# EAGLE design referenceCard (EAGLE 7.1.0)
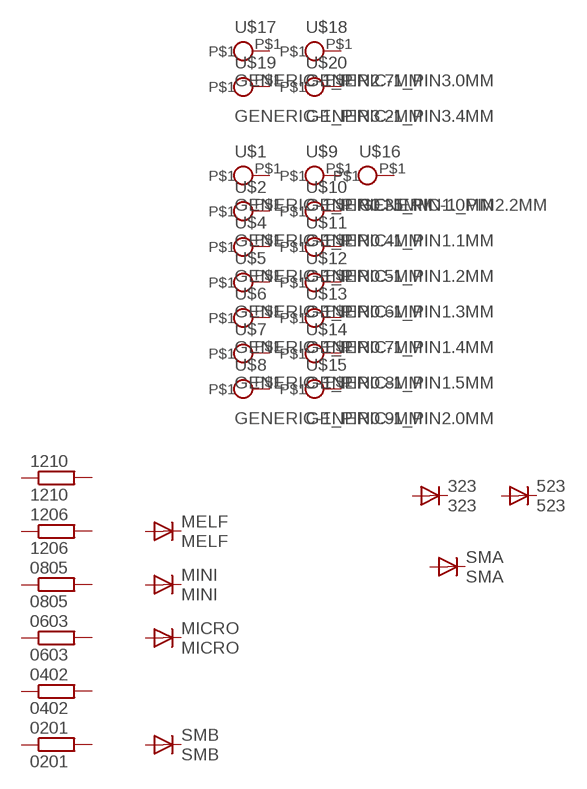
[diagram p0: schematic, sheet 1]

## Parts
0201  0201  R-EU_R0201  [R0201]
323  323  DIODESOD  [SOD-323]
0402  0402  R-EU_R0402  [R0402]
523  523  DIODESOD523  [SOD523]
0603  0603  R-EU_R0603  [R0603]
0805  0805  R-EU_R0805  [R0805]
1206  1206  R-EU_R1206  [R1206]
1210  1210  R-EU_R1210  [R1210]
MELF  MELF  DIODE-MELF-MLL41  [MELF-MLL41]
MICRO  MICRO  DIODE-MICROMELF-R  [MICROMELF-R]
MINI  MINI  DIODE-MINIMELF  [MINIMELF]
SMA  SMA  DIODESMA-KIT  [SMA-DIODE-KIT]
SMB  SMB  DIODESMB  [SMB-DIODE]
U$1  GENERIC-1_PIN0.35MM  [GENERIC-SINGLE-0_35]
U$2  GENERIC-1_PIN0.4MM  [GENERIC_SINGLE-0_4]
U$4  GENERIC-1_PIN0.5MM  [GENERIC_SINGLE-0_5]
U$5  GENERIC-1_PIN0.6MM  [GENERIC_SINGLE-0_6]
U$6  GENERIC-1_PIN0.7MM  [GENERIC_SINGLE-0_7]
U$7  GENERIC-1_PIN0.8MM  [GENERIC_SINGLE-0_8]
U$8  GENERIC-1_PIN0.9MM  [GENERIC_SINGLE-0_9]
U$9  GENERIC-1_PIN1.0MM  [GENERIC_SINGLE-1_0]
U$10  GENERIC-1_PIN1.1MM  [GENERIC_SINGLE-1_1]
U$11  GENERIC-1_PIN1.2MM  [GENERIC_SINGLE-1_2]
U$12  GENERIC-1_PIN1.3MM  [GENERIC_SINGLE-1_3]
U$13  GENERIC-1_PIN1.4MM  [GENERIC_SINGLE-1_4]
U$14  GENERIC-1_PIN1.5MM  [GENERIC_SINGLE-1_5]
U$15  GENERIC-1_PIN2.0MM  [GENERIC_SINGLE-2_0]
U$16  GENERIC-1_PIN2.2MM  [GENERIC_SINGLE-2_2]
U$17  GENERIC-1_PIN2.7MM  [GENERIC_SINGLE-2_7]
U$18  GENERIC-1_PIN3.0MM  [GENERIC_SINGLE-3_0]
U$19  GENERIC-1_PIN3.2MM  [GENERIC_SINGLE-3_2]
U$20  GENERIC-1_PIN3.4MM  [GENERIC_SINGLE-3_4]
Unconnected: 0201.1 0201.2 323.1(C) 323.2(A) 0402.1 0402.2 523.A 523.C 0603.1 0603.2 0805.1 0805.2 1206.1 1206.2 1210.1 1210.2 MELF.A MELF.C MICRO.A MICRO.C MINI.A MINI.C SMA.A SMA.C SMB.A SMB.C U$1.P$1 U$2.P$1 U$4.P$1 U$5.P$1 U$6.P$1 U$7.P$1 U$8.P$1 U$9.P$1 U$10.P$1 U$11.P$1 U$12.P$1 U$13.P$1 U$14.P$1 U$15.P$1 U$16.P$1 U$17.P$1 U$18.P$1 U$19.P$1 U$20.P$1

## Library data of the parts
0201 0402 0603 0805 1206 1210 = rcl:R-EU_: RESISTOR, European symbol
323 523 SMA SMB = SparkFun-DiscreteSemi:DIODE: Diode These are standard reverse protection diodes and small signal diodes. SMA package can handle up to about 1A. SOD-323 can handle about 200mA. What the SOD-323 package when ordering, there are some mfgs out there that are 5-pin packages.
MELF MICRO MINI = diode:DIODE-: DIODE
U$1 U$2 U$4-U$20 = p.peter-connectors:GENERIC-1_PIN

## Board
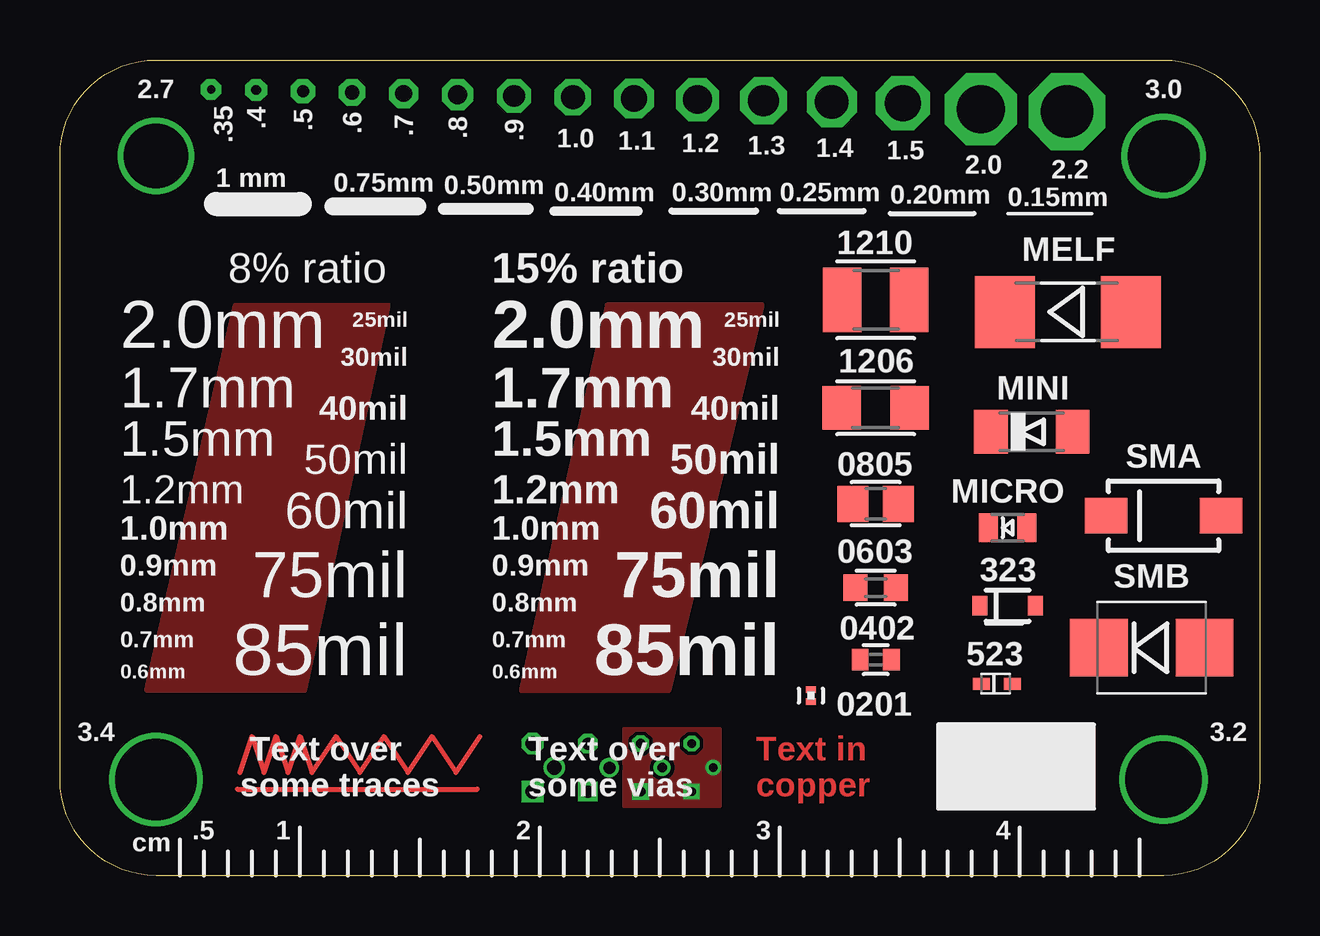
[diagram p1: board, top side]
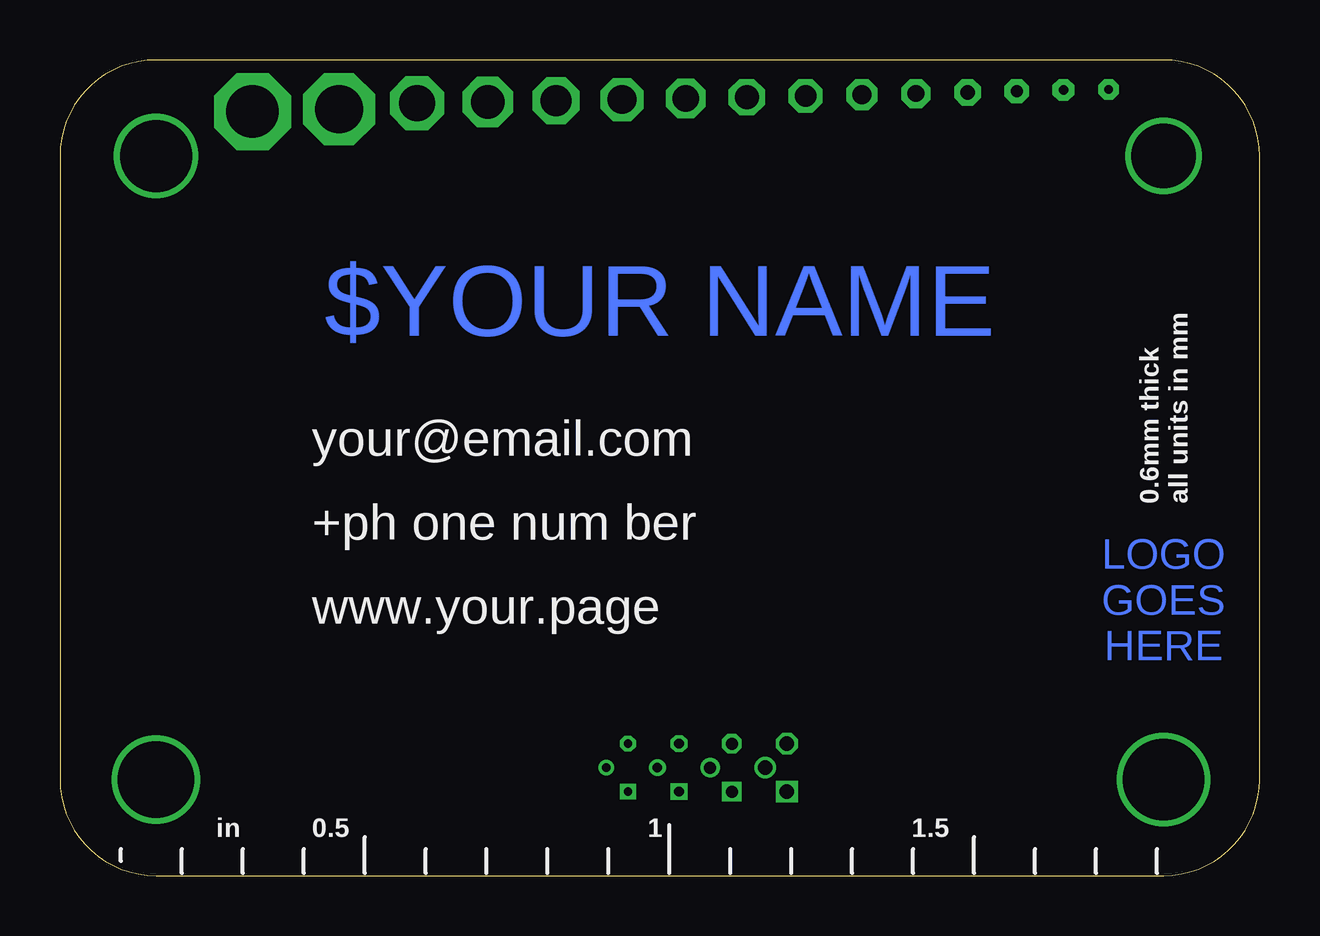
[diagram p2: board, bottom side, seen from below]

Size 50 x 34 mm. Coordinates in mm from the lower left corner, seen from the top.
Copper layers (1*16): Top 0.035mm / dielectric 1.5mm / Bottom 0.035mm
Design rules "Fusion_eagle_rule_v1.1 *": minimum track width 6mil, minimum drill 0.3mm, track to track 6mil, track to pad 6mil, pad to pad 6mil, via to via 6mil, smd to smd 0mil, copper to edge 10mil, drill to drill 10mil, minimum pad ring 10mil, minimum via ring 6mil, stop-mask expansion 2mil, vias tented up to drill 100mil, thermal gap 10mil

### Footprints (pad centres in the part's own frame; a part is rotated, then mirrored left to right if it is on the bottom)
R0201 = smd 0.28 x 0.43: 1 -0.255,0; 2 0.255,0
SOD-323 = smd 0.63 x 0.83: 1 -1.15,0; 2 1.15,0
R0402 = smd 0.7 x 0.9: 1 -0.65,0; 2 0.65,0
SOD523 = smd 0.7 x 0.5: A 0.7,0; C -0.6,0
R0603 = smd 1 x 1.1: 1 -0.85,0; 2 0.85,0
R0805 = smd 1.3 x 1.5: 1 -0.95,0; 2 0.95,0
R1206 = smd 1.6 x 1.803: 1 -1.422,0; 2 1.422,0
R1210 = smd 1.6 x 2.7: 1 -1.4,0; 2 1.4,0
MELF-MLL41 = smd 2.5 x 3: A 2.625,0; C -2.625,0
MICROMELF-R = smd 0.8 x 1.2: A 0.8,0; C -0.8,0
MINIMELF = smd 1.4 x 1.8: A 1.7,0; C -1.7,0
SMA-DIODE-KIT = smd 1.77 x 1.47: A -2.4,0; C 2.4,0
SMB-DIODE = smd 2.4 x 2.4: A 2.2,0; C -2.2,0
GENERIC-SINGLE-0_35 = drill 0.35 octagon: P$1 0,0
GENERIC_SINGLE-0_4 = drill 0.4 octagon: P$1 0,0
GENERIC_SINGLE-0_5 = drill 0.5 octagon: P$1 0,0
GENERIC_SINGLE-0_6 = drill 0.6 octagon: P$1 0,0
GENERIC_SINGLE-0_7 = drill 0.7 octagon: P$1 0,0
GENERIC_SINGLE-0_8 = drill 0.8 octagon: P$1 0,0
GENERIC_SINGLE-0_9 = drill 0.9 octagon: P$1 0,0
GENERIC_SINGLE-1_0 = drill 1 octagon: P$1 0,0
GENERIC_SINGLE-1_1 = drill 1.1 pad 1.65 octagon: P$1 0,0
GENERIC_SINGLE-1_2 = drill 1.2 pad 1.8 octagon: P$1 0,0
GENERIC_SINGLE-1_3 = drill 1.3 pad 1.95 octagon: P$1 0,0
GENERIC_SINGLE-1_4 = drill 1.4 pad 2.1 octagon: P$1 0,0
GENERIC_SINGLE-1_5 = drill 1.5 pad 2.25 octagon: P$1 0,0
GENERIC_SINGLE-2_0 = drill 2 pad 3 octagon: P$1 0,0
GENERIC_SINGLE-2_2 = drill 2.2 pad 3.2 octagon: P$1 0,0
GENERIC_SINGLE-2_7 = drill 2.7 pad 3: P$1 0,0
GENERIC_SINGLE-3_0 = drill 3 pad 3.3: P$1 0,0
GENERIC_SINGLE-3_2 = drill 3.2 pad 3.5: P$1 0,0
GENERIC_SINGLE-3_4 = drill 3.4 pad 3.7: P$1 0,0

### Placement (x,y rotation side)
0201  31.3,7.5 90 top
323  39.5,11.25 0 top
0402  34,9 0 top
523  39,8 0 top
0603  34,12 0 top
0805  34,15.5 0 top
1206  34,19.5 0 top
1210  34,24 0 top
MELF  42,23.5 0 top
MICRO  39.5,14.5 0 top
MINI  40.5,18.5 0 top
SMA  46,15 180 top
SMB  45.5,9.5 0 top
U$1  6.3,32.77 0 top
U$2  8.18,32.75 0 top
U$4  10.12,32.7 0 top
U$5  12.18,32.65 0 top
U$6  14.32,32.6 0 top
U$7  16.57,32.55 0 top
U$8  18.93,32.5 0 top
U$9  21.38,32.45 0 top
U$10  23.93,32.4 0 top
U$11  26.57,32.35 0 top
U$12  29.32,32.3 0 top
U$13  32.17,32.25 0 top
U$14  35.12,32.2 0 top
U$15  38.38,31.95 0 top
U$16  41.98,31.85 0 top
U$17  4,30 0 top
U$18  46,30 0 top
U$19  46,4 0 top
U$20  4,4 0 top
U$22  [BOARD_SIZE-BUSINESS_CARD-SMALL]  25,17 0 top

### Tracks (layer width: path | path; a pad name or v marks a point on that pad's centre or on a via)
GND  (via drill 0.35, 0.4)
  other vias: 27.23,4.5 24.2,3.5 26.32,3.5
  pour Top: 23.5,2.9 27.5,2.9 27.5,6.1 23.5,6.1
N$1
  Top 0.2: 7.4,3.6 17.4,3.6
N$2
  Top 0.2: 7.5,4.3 8,5.8 8.5,4.3 9,5.8 9.5,4.3 10,5.8 10.5,4.3 11.5,5.8 12.5,4.3 13.5,5.8 14.5,4.3 15.5,5.8 16.5,4.3 17.5,5.8
N$3  (via drill 0.5)
  other vias: 22,3.5
N$4  (via drill 0.5)
  other vias: 22,5.5
N$5  (via drill 0.4)
  other vias: 24.2,5.5
N$8
  pour Top: 39.85,6.3 39.85,2.8 43.1,2.8 43.1,6.3
N$9  (via drill 0.6)
  other vias: 20.6,4.5
N$10  (via drill 0.5)
  other vias: 22.9,4.5
N$11  (via drill 0.4)
  other vias: 25.1,4.5
N$13  (via drill 0.35)
  other vias: 26.32,5.5
N$14  (via drill 0.6)
  other vias: 19.7,5.5
N$15  (via drill 0.6)
  other vias: 19.7,3.5
N$24
  pour Top: 10.2,7.7 3.6,7.7 7.3,23.8 13.7,23.8
N$26
  pour Top: 19.2,7.7 25.4,7.7 29.3,23.8 22.8,23.8

### Text on the board
Top: Text in / copper
Bottom: $YOUR NAME | LOGO / GOES / HERE
tPlace: 2.7 | 3.0 | .35 | .4 | .5 | .6 | .7 | .8 | .9 | 1.0 | 1.1 | 1.2 | 1.3 | 1.4 | 1.5 | 2.0 | 2.2 | 1 mm | 0.75mm | 0.50mm | 0.40mm | 0.30mm | 0.25mm | 0.20mm | 0.15mm | 8% ratio | 15% ratio | 25mil | 25mil | 2.0mm | 30mil | 2.0mm | 30mil | 1.7mm | 40mil | 1.7mm | 40mil | 1.5mm | 50mil | 1.5mm | 50mil | 1.2mm | 60mil | 1.2mm | 60mil | 1.0mm | 75mil | 1.0mm | 75mil | 0.9mm | 0.9mm | 0.8mm | 0.8mm | 0.7mm | 85mil | 0.7mm | 85mil | 0.6mm | 0.6mm | 3.4 | 3.2 | Text over / some traces | Text over / some vias | .5 | 1 | 2 | 3 | 4 | cm
bPlace: your@email.com | 0.6mm thick / all units in mm | +ph one num ber | www.your.page | 1.5 | 1 | 0.5 | in
tStop: Inverse / text
bStop: $YOUR NAME